# Altium schematic sheet Main.SchDoc
size A3; SheetNumber: 1
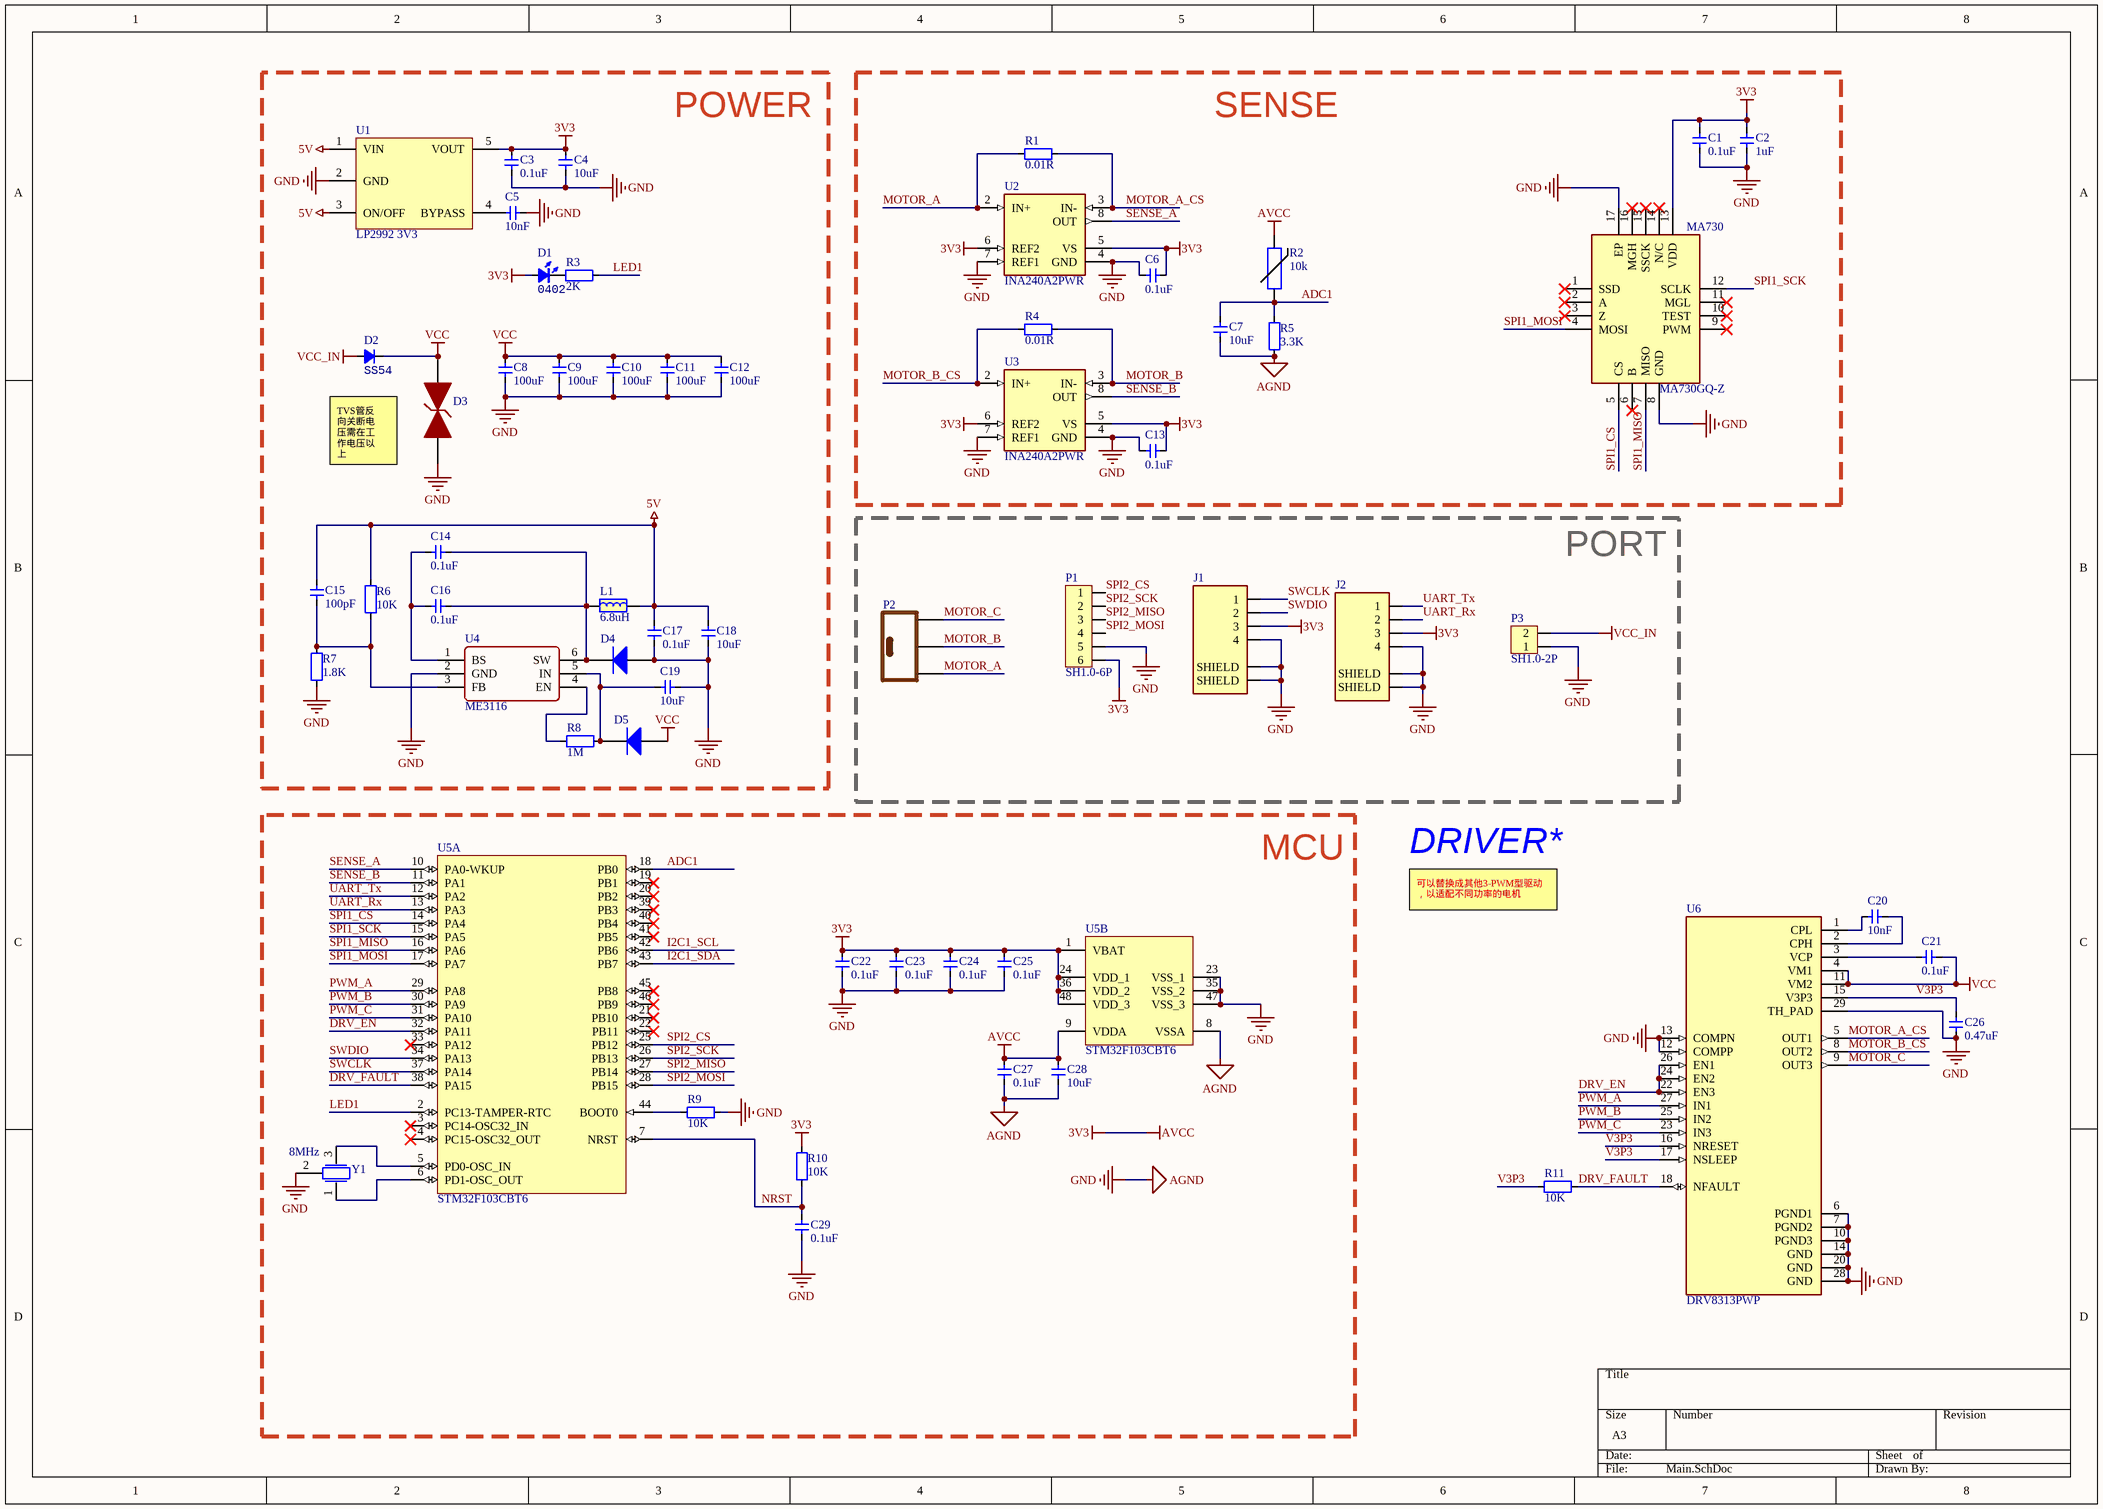
[diagram p0: Main.SchDoc]

## Parts
C1  0.1uF  [CAP_0402]
C2  1uF  [CAP_0402]
C3  0.1uF  [CAP_0402]
C4  10uF  [CAP_0402]
C5  10nF  [CAP_0402]
C6  0.1uF  [CAP_0402]
C7  10uF  [CAP_0402]
C8  100uF  [1206-CAP]
C9  100uF  [1206-CAP]
C10  100uF  [1206-CAP]
C11  100uF  [1206-CAP]
C12  100uF  [1206-CAP]
C13  0.1uF  [CAP_0402]
C14  0.1uF  [CAP_0402]
C15  100pF  [CAP_0402]
C16  0.1uF  [CAP_0402]
C17  0.1uF  [CAP_0402]
C18  10uF  [CAP_0402]
C19  10uF  [CAP_0402]
C20  10nF  [CAP_0402]
C21  0.1uF  [CAP_0402]
C22  0.1uF  [CAP_0402]
C23  0.1uF  [CAP_0402]
C24  0.1uF  [CAP_0402]
C25  0.1uF  [CAP_0402]
C26  0.47uF  [CAP_0402]
C27  0.1uF  [CAP_0402]
C28  10uF  [CAP_0402]
C29  0.1uF  [CAP_0402]
D1  Type: 0402  [LED_0402_RED]  (hidden comment: color?)
D2  SS54  [DO-214AC]
D3  SMBJ28CA  [SMBJ-CA_MFG]  (value not drawn)
D4  二极管-5B5819WS  [SOD-323]  (value not drawn)
D5  二极管-5B5819WS  [SOD-323]  (value not drawn)
J1  SM04B-SRSS-TB(LF)(SN)  [JST_SM04B-SRSS-TB(LF)(SN)]  (value not drawn)
J2  SM04B-SRSS-TB(LF)(SN)  [JST_SM04B-SRSS-TB(LF)(SN)]  (value not drawn)
L1  6.8uH  [IND-201612]
MA730  MA730GQ-Z  [QFN50P300X300X100-17N-D]
P1  SH1.0-6P  [SH1.0-6P]
P2  电机接插件-3P  [AMASS-MR30-M]  (value not drawn)
P3  SH1.0-2P  [SH1.0-2P]
R1  0.01R  [1206-RES]
R2  value 10k  [RES_0402]  (hidden comment: NCP15XH103F03RC)
R3  2K  [RES_0402]
R4  0.01R  [1206-RES]
R5  3.3K  [RES_0402]
R6  10K  [RES_0402]
R7  1.8K  [RES_0402]
R8  1M  [RES_0402]
R9  10K  [RES_0402]
R10  10K  [RES_0402]
R11  10K  [RES_0402]
U1  LP2992 3V3  [SOT23-5]
U2  INA240A2PWR  [SOP65 P640X120-8N]
U3  INA240A2PWR  [SOP65 P640X120-8N]
U4  ME3116  [SOT23-6]
U5  STM32F103CBT6  [LQFP-48]  (parts A,B of 2)
U6  DRV8313PWP  [HTSSOP-28]
Y1  8MHz  [晶振-3P]

## Blocks framed on the sheet
POWER: C3-C5 C8-C12 C14-C19 D1-D5 L1 R3 R6-R8 U1 U4
SENSE: C1 C2 C6 C7 C13 MA730 R1 R2 R4 R5 U2 U3
PORT: J1 J2 P1-P3
MCU: C22-C25 C27-C29 R9 R10 U5 Y1

## Nets
3V3: C1.1 C2.1 C3.2 C4.2 C6.1 C13.1 C22.2 C23.2 C24.2 C25.2 C27.2 C28.2 D1.1(A) J1.3 J2.3 MA730.13(VDD) P1.6 R2.2 R10.2 U1.5(VOUT) U2.5(VS) U2.6(REF2) U3.5(VS) U3.6(REF2) U5.1(VBAT) U5.9(VDDA) U5.24(VDD_1) U5.36(VDD_2) U5.48(VDD_3)  [also labelled AVCC]
5V: C15.1 C17.2 C18.2 L1.2 R6.2 U1.1(VIN) U1.3(ON/OFF)
AGND: C1.2 C2.2 C3.1 C4.1 C5.1 C6.2 C7.1 C8.1 C9.1 C10.1 C11.1 C12.1 C13.2 C17.1 C18.1 C19.1 C22.1 C23.1 C24.1 C25.1 C26.1 C27.1 C28.1 C29.1 D3.1 D4.1(A) J1.4 J1.S1(SHIELD) J1.S2(SHIELD) J2.4 J2.S1(SHIELD) J2.S2(SHIELD) MA730.8(GND) MA730.17(EP) P1.5 P3.1 R5.1 R7.1 R9.1 U1.2(GND) U2.4(GND) U2.7(REF1) U3.4(GND) U3.7(REF1) U4.2(GND) U5.8(VSSA) U5.23(VSS_1) U5.35(VSS_2) U5.47(VSS_3) U6.6(PGND1) U6.7(PGND2) U6.10(PGND3) U6.12(COMPP) U6.13(COMPN) U6.14(GND) U6.20(GND) U6.28(GND) U6.29(TH_PAD) Y1.2  [also labelled GND]
VCC: C8.2 C9.2 C10.2 C11.2 C12.2 C21.2 D2.2(K) D3.2 D5.1(A) U6.4(VM1) U6.11(VM2)
VCC_IN: D2.1(A) P3.2
ADC1: C7.2 R2.1 R5.2 U5.18(PB0)
DRV_EN: U5.32(PA11) U6.22(EN3) U6.24(EN2) U6.26(EN1)
DRV_FAULT: R11.2 U5.38(PA15) U6.18(NFAULT)
I2C1_SCL: U5.42(PB6)
I2C1_SDA: U5.43(PB7)
LED1: R3.1 U5.2(PC13-TAMPER-RTC)
MOTOR_A: P2.1 R1.1 U2.2(IN+)
MOTOR_A_CS: R1.2 U2.3(IN-) U6.5(OUT1)
MOTOR_B: P2.2 R4.2 U3.3(IN-)
MOTOR_B_CS: R4.1 U3.2(IN+) U6.8(OUT2)
MOTOR_C: P2.3 U6.9(OUT3)
NRST: C29.2 R10.1 U5.7(NRST)
PWM_A: U5.29(PA8) U6.27(IN1)
PWM_B: U5.30(PA9) U6.25(IN2)
PWM_C: U5.31(PA10) U6.23(IN3)
SENSE_A: U2.8(OUT) U5.10(PA0-WKUP)
SENSE_B: U3.8(OUT) U5.11(PA1)
SPI1_CS: MA730.5(CS) U5.14(PA4)
SPI1_MISO: MA730.7(MISO) U5.16(PA6)
SPI1_MOSI: MA730.4(MOSI) U5.17(PA7)
SPI1_SCK: MA730.12(SCLK) U5.15(PA5)
SPI2_CS: P1.1 U5.25(PB12)
SPI2_MISO: P1.3 U5.27(PB14)
SPI2_MOSI: P1.4 U5.28(PB15)
SPI2_SCK: P1.2 U5.26(PB13)
SWCLK: J1.1 U5.37(PA14)
SWDIO: J1.2 U5.34(PA13)
UART_Rx: J2.2 U5.13(PA3)
UART_Tx: J2.1 U5.12(PA2)
V3P3: C26.2 R11.1 U6.15(V3P3) U6.16(NRESET) U6.17(NSLEEP)
NetC5_2: C5.2 U1.4(BYPASS)
NetC14_1: C14.1 C16.1 D4.2(K) L1.1 U4.6(SW)
NetC14_2: C14.2 C16.2 U4.1(BS)
NetC15_2: C15.2 R6.1 R7.2 U4.3(FB)
NetC19_2: C19.2 D5.2(K) R8.1 U4.5(IN)
NetC20_1: C20.1 U6.1(CPL)
NetC20_2: C20.2 U6.2(CPH)
NetC21_1: C21.1 U6.3(VCP)
NetD1_2: D1.2(K) R3.2
NetR8_2: R8.2 U4.4(EN)
NetR9_2: R9.2 U5.44(BOOT0)
NetU5_5: U5.5(PD0-OSC_IN) Y1.3
NetU5_6: U5.6(PD1-OSC_OUT) Y1.1

Not connected (* = marked no-connect by the designer): MA730 1(SSD)* 2(A)* 3(Z)* 6(B)* 9(PWM)* 10(TEST)* 11(MGL)* 14(N/C)* 15(SSCK)* 16(MGH)*; U5 3(PC14-OSC32_IN)* 4(PC15-OSC32_OUT)* 19(PB1)* 20(PB2)* 21(PB10)* 22(PB11)* 33(PA12)* 39(PB3)* 40(PB4)* 41(PB5)* 45(PB8)* 46(PB9)*

## Notes on the sheet
- TVS管反
  向关断电
  压需在工
  作电压以
  上
- DRIVER*
- 可以替换成其他3-PWM型驱动，以适配不同功率的电机

## Library data of the parts
C1-C7 C13-C29 = 电容-0402: Capacitor; Value: 0.1u
C8-C12 = 电容-1206: Capacitor; Value: 0.1u
D1 = LED_0402: LED; Value: color?
D2 = Diode_SMA: Diode; Type: SMA; Value: SS54
D4 D5 = 二极管-5B5817WS: 40V
J1 J2 = SM04B-SRSS-TB(LF)(SN): Connector Header Surface Mount, Right Angle 4 position 0.039 _1.00mm_; MF: JST Sales; MP: SM04B-SRSS-TB_LF__SN_; Price: None; SnapEDA_Link: https://www.snapeda.com/parts/SM04B-SRSS-TB%28LF%29%28SN%29/JST%20Sales%20America%20Inc./view-part/557466/?ref=snap; Value: *; Availability: Unavailable; Package: None
L1 = 电感-201612
MA730 = MA730GQ-Z: Integrated Circuit; Manufacturer_Name: Monolithic Power Systems (MPS); Datasheet Link: https://www.monolithicpower.com/pub/media/document/m/a/ma730_r1.01.pdf; Height: 1mm; Manufacturer_Part_Number: MA730GQ-Z; Mouser Part Number: 946-MA730GQ-Z; Mouser Price/Stock: https://www.mouser.co.uk/ProductDetail/Monolithic-Power-Systems-MPS/MA730GQ-Z?qs=YCa%2FAAYMW01z3klrRj76PA%3D%3D
P2 = 电机接插件-3P: AMASS MR30
R1 R4 = 电阻-1206: Resistor; Value: 22R
R2 = NCP15XH103F03RC: THERMISTOR 10K OHM NTC 0402 SMD
R3 R5-R11 = 电阻-0402: Resistor; Value: 22R
U1 = LP2992: LDO
U2 U3 = INA240A2PWR: -4 to 80V, bidirectional, ultra-precise current sense amplifier with enhanced PWM rejection 8-TSSOP -40 to 125; MF: Texas Instruments; MP: INA240A2PWR; Value: *; Package: TSSOP-8 Texas Instruments; Price: None; Availability: Good; Purchase-URL: https://pricing.snapeda.com/search/part/INA240A2PWR/?ref=eda; SnapEDA_Link: https://www.snapeda.com/parts/INA240A2PWR/Texas%20Instruments/view-part/588604/?ref=snap
U4 = ME3116: DC-DC
U5 = STM32F103CBT6: ARM Cortex-M3 32-bit MCU, 128 KB Flash, 20 KB Internal RAM, 37 I/Os, 48-pin LQFP, -40 to 85 degC, Tray; A/D Converter: 2x12-bit (10 Channel); FLASH Size (Prog) (kB): 128; I/Os (High Current): 37; Internal RAM Size (kB): 20; Operating Frequency(F) (Processor speed) (MHz): 72; Supply Voltage(Vcc) min (V): 2; DatasheetVersion: Rev. 16; PackageVersion: Rev. 6, 06/2013; PackageReference: LQFP48; PackageDescription: 48-Pin Low Profile Quad Flat Package, 7 x 7 mm Body, 0.5 mm Pitch; Supplier 1: Digi-Key; Supplier Part Number 1: 497-6288-ND; Supplier 2: Farnell; Supplier Part Number 2: 1606327; Supplier 3: Newark; Supplier Part Number 3: 11N8296; Supplier 4: Newark; Supplier Part Number 4: 57P1214; Supplier 5: Mouser; Supplier Part Number 5: 511-STM32F103CBT6; Core: ARM Cortex-M3; Packing: Tray; Mounting Technology: Surface Mount; PartNumber: STM32F103CBT6; ComponentLink1Description: Manufacturer URL; ComponentLink1URL: http://www.st.com/web/en/home.html; ComponentLink2Description: Datasheet; ComponentLink2URL: http://www.st.com/st-web-ui/static/active/en/resource/technical/document/datasheet/CD00161566.pdf; ComponentLink3Description: Package Specification; ComponentLink3URL: http://www.st.com/st-web-ui/static/active/en/resource/technical/document/datasheet/DM00058181.pdf
U6 = DRV8313PWP: 65-V max, 3-A peak 3-phase motor driver 28-HTSSOP -40 to 125; MF: Texas Instruments; Availability: Good; SnapEDA_Link: https://www.snapeda.com/parts/DRV8313PWP/Texas%20Instruments/view-part/287728/?ref=snap; Price: None; MP: DRV8313PWP; Purchase-URL: https://pricing.snapeda.com/search/part/DRV8313PWP/?ref=eda; Package: HTSSOP-28 Texas Instruments; Value: *
Y1 = 晶振-3Pin: 村田贴片